# Altium schematic sheet Sheet1.SchDoc
size A
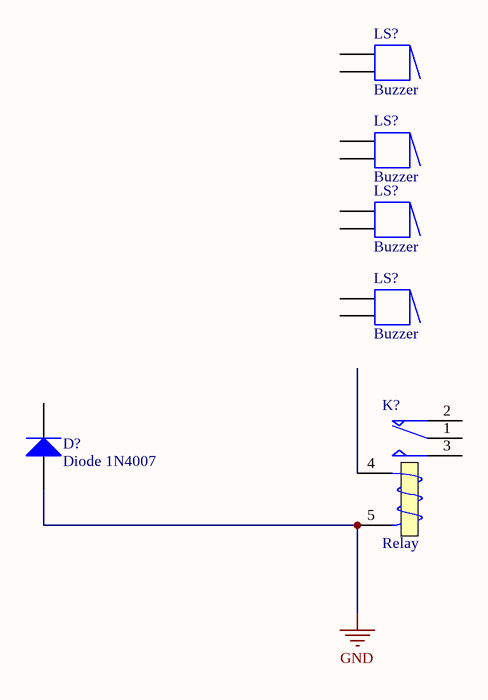
[diagram p0: Sheet1.SchDoc]

## Parts
(Parts that share a designator on the sheet are numbered #1, #2 ... from top to bottom, then left to right.)
D?  Diode 1N4007  [DO-41]
K?  Relay  [MODULE5B]
LS?#1  Buzzer  [ABSM-1574]
LS?#2  Buzzer  [ABSM-1574]
LS?#3  Buzzer  [ABSM-1574]
LS?#4  Buzzer  [ABSM-1574]

## Nets
GND: D?.1(A) K?.5(T2)
NetLS?#1_1: LS?#1.1 LS?#1.1A
NetLS?#1_2: LS?#1.2 LS?#1.2A
NetLS?#2_1: LS?#2.1 LS?#2.1A
NetLS?#2_2: LS?#2.2 LS?#2.2A
NetLS?#3_1: LS?#3.1 LS?#3.1A
NetLS?#3_2: LS?#3.2 LS?#3.2A
NetLS?#4_1: LS?#4.1 LS?#4.1A
NetLS?#4_2: LS?#4.2 LS?#4.2A

Not connected (* = marked no-connect by the designer): D? 2(K); K? 1(COM) 2(NC) 3(NO) 4(T1)

## Library data of the parts
D? = Diode 1N4007: 1 Amp General Purpose Rectifier; Published: 8-Jun-2000; LatestRevisionDate: 17-Jul-2002; LatestRevisionNote: Re-released for DXP Platform.; DatasheetVersion: 1998; PackageVersion: Aug-1999; PackageReference: DO-41; Publisher: Altium Limited; PackageDescription: Diode, Axial; Body 5.2 x 2.7 mm (LxDia. max), Lead Dia. 0.86 mm (max); Code_JEDEC: DO-204-AL; ComponentLink1Description: Manufacturer Link; ComponentLink1URL: http://www.fairchildsemi.com/; ComponentLink2Description: Datasheet; ComponentLink2URL: http://www.fairchildsemi.com/ds/1N%2F1N4001.pdf
K? = Relay: SPDT Relay; Published: 8-Jun-2000; LatestRevisionDate: 17-Jul-2002; LatestRevisionNote: Re-released for DXP Platform.; PackageReference: MODULE5B; Publisher: Altium Limited
LS?#1-LS?#4 = Buzzer: Magnetic Transducer Buzzer; Published: 24-Mar-1999; LatestRevisionDate: 17-Dec-2003; LatestRevisionNote: Schematic revised, PCB Footprint replaced.; DatasheetVersion: 17-Dec-2003; PackageReference: ABSM-1574; Publisher: Altium Limited; PackageDescription: Magnetic Transducer Buzzer; ComponentLink1Description: Manufacturer Link; ComponentLink1URL: http://www.megastar.com/linecard/buzzmode/index.php